# Altium schematic sheet Sheet1.SchDoc
size A4; SheetNumber: 1; SheetTotal: 1; SPICEModelCacheYPGFAYGY: <root> / <DocumentId>YPGFAYGY</DocumentId> / </root>
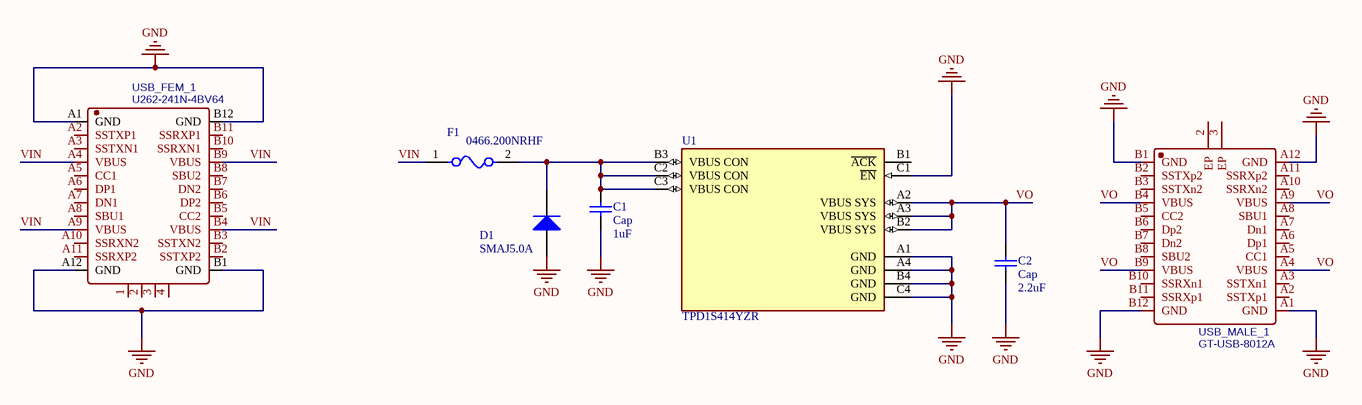
[diagram p0: Sheet1.SchDoc]

## Parts
C1  Cap  value 1uF  [6-0805_N]
C2  Cap  value 2.2uF  [6-0805_N]
D1  SMAJ5.0A  [BOUR-SMA-2_V]
F1  0466.200NRHF  [FP-0466-MFG]
U1  TPD1S414YZR  [FP-YZ0012-C02-MFG]
USB_FEM_1  U262-241N-4BV64  [usbc-female]
USB_MALE_1  GT-USB-8012A  [PCBComponent_1]

## Nets
GND: C1.1 C2.1 D1.1(A) U1.A1(GND) U1.A4(GND) U1.B4(GND) U1.C1(~{EN}) U1.C4(GND) USB_FEM_1.A1(GND) USB_FEM_1.A12(GND) USB_FEM_1.B1(GND) USB_FEM_1.B12(GND) USB_MALE_1.A1(GND) USB_MALE_1.A12(GND) USB_MALE_1.B1(GND) USB_MALE_1.B12(GND)
VIN: F1.1 USB_FEM_1.A4(VBUS) USB_FEM_1.A9(VBUS) USB_FEM_1.B4(VBUS) USB_FEM_1.B9(VBUS)
VO: C2.2 U1.A2(VBUS_SYS) U1.A3(VBUS_SYS) U1.B2(VBUS_SYS) USB_MALE_1.A4(VBUS) USB_MALE_1.A9(VBUS) USB_MALE_1.B4(VBUS) USB_MALE_1.B9(VBUS)
NetC1_2: C1.2 D1.2(K) F1.2 U1.B3(VBUS_CON) U1.C2(VBUS_CON) U1.C3(VBUS_CON)

Not connected (* = marked no-connect by the designer): U1 B1(~{ACK}); USB_FEM_1 1 2 3 4 A2(SSTXP1) A3(SSTXN1) A5(CC1) A6(DP1) A7(DN1) A8(SBU1) A10(SSRXN2) A11(SSRXP2) B2(SSTXP2) B3(SSTXN2) B5(CC2) B6(DP2) B7(DN2) B8(SBU2) B10(SSRXN1) B11(SSRXP1); USB_MALE_1 2(EP) 3(EP) A2(SSTXp1) A3(SSTXn1) A5(CC1) A6(Dp1) A7(Dn1) A8(SBU1) A10(SSRXn2) A11(SSRXp2) B2(SSTXp2) B3(SSTXn2) B5(CC2) B6(Dp2) B7(Dn2) B8(SBU2) B10(SSRXn1) B11(SSRXp1)

## Library data of the parts
C1 = Cap: 0805B105K500NT; Published: 8-Jun-2000; LatestRevisionDate: 17-Jul-2002; LatestRevisionNote: Re-released for DXP Platform.; PackageReference: RAD-0.3; Publisher: Altium Limited; PackageDescription: Radial Cap, Thru-Hole; 2 Leads; 0.3 in Pin Spacing
C2 = Cap: 0805F225M500NT; Published: 8-Jun-2000; LatestRevisionDate: 17-Jul-2002; LatestRevisionNote: Re-released for DXP Platform.; PackageReference: RAD-0.3; Publisher: Altium Limited; PackageDescription: Radial Cap, Thru-Hole; 2 Leads; 0.3 in Pin Spacing
D1 = CMP-2000-07090-1: SMAJ Transient Voltage Suppressor Diode Series, 3.5 V, -55 to 150 degC, 2-Pin SMA, RoHS, Tape and Reel; Manufacturer: Bourns; EDA / CAD Models: DownloadfromAcceleratedDesigns; Unidirectional Channels: 1; Voltage - Breakdown (Min): 6.4V; Voltage - Reverse Standoff (Typ): 5V; Voltage - Clamping (Max) @ Ipp: 9.2V; Other Names: SMAJ5.0ABDKR; Type: Zener; Catalog Drawings: SMAJSeriesFootprintSMAJ,SMBJSeries; Featured Product: SMAJ/SMBJ/SMCJ/SMLJDiscreteTVSDiodes; Power - Peak Pulse: 400W; Current - Peak Pulse (10/1000µs): 43.5A; Power Line Protection: No; Online Catalog: SMAJSeries; Supplier Device Package: SMA(DO-214AC); Operating Temperature: -55°C~150°C(TJ); Package Description: 2-Pin Surface Mount Device, Body 4.315 x 2.605 mm; Datasheet URL: https://datasheet.ciiva.com/25624/0900766b8112213b-25624680.pdf; Manufacturer URL: http://www.bourns.com/; Datasheet Version: 08/2012; Series: SMAJ; Family: TVS-Diodes; Bidirectional Channels: -; Applications: GeneralPurpose; Package Reference: SMA-2; Standard Package: 1; Package / Case: DO-214AC,SMA; Category: CircuitProtection; RoHS Information: SMAJSeriesMaterialDeclaration; Mounting Technology: SurfaceMount; Capacitance @ Frequency: -; Packaging: Digi-Reel®; Mounting Type: SurfaceMount
F1 = CMP-08605-000096-1: FUSE BOARD MNT 200MA 125VAC/VDC; Approvals: UL; Voltage Rating (DC): 125V; Power Dissipation: 50.9mW; Fuse Type: Board Mount (Cartridge Style Excluded); DC Cold Resistance: 1.16R; Housing Material: Ceramic; Length: 3.18mm; Package Quantity: 5000; Current: 200mA; Min Operating Temperature: -55°C; Case Code (Imperial): 1206; Max Operating Temperature: 90°C; Series: SlimLine™ 466; Current Rating: 200mA; Case Code (Metric): 3216; RoHS Compliant: Yes; Depth: 1.52mm; Voltage Rating (AC): 125V; Number of Pins: 2; Lead Free: Contains Lead; Mount: Surface Mount; Height: 0.023inch; Radiation Hardening: No; Width: 0.06inch; Packaging: Tape and Reel; Case/Package: SMD/SMT
U1 = CMP-04910-000132-1: IC PWR SWITCH N-CHAN 1:1 12DSBGA; Output Configuration: High Side; Input Current: 3.5A; Number of Outputs: 1; Operating Supply Voltage: 30V; Fault Protection: Over Temperature; Interface: USB; RoHS Compliant: Yes; Operating Supply Current: 3.5A; Radiation Hardening: No; Max Operating Temperature: 85°C; Lead Free: Lead Free; Number of Pins: 12; Packaging: Tape and Reel; Package Quantity: 3000; Number of Channels: 1; Min Operating Temperature: -40°C
USB_FEM_1 = U262-241N-4BV64: Female USB-TYPE-C; BOM_Manufacturer: XKB Enterprise; Contributor: LCSC; BOM_Supplier: LCSC; BOM_Supplier Part: C388660; BOM_Manufacturer Part: U262-241N-4BV64; BOM_JLCPCB Part Class: Extended Part; spicePre: U; spiceSymbolName: U262-241N-4BV64
USB_MALE_1 = GT-USB-8012A: MALE-USB-TYPE-C; BOM_Manufacturer: G-Switch(品赞); Contributor: lcsc; BOM_Supplier: LCSC; BOM_Supplier Part: C2982483; BOM_Manufacturer Part: GT-USB-8012A; link: https://atta.szlcsc.com/upload/public/pdf/source/20220429/9F8815E2CFA8FB68F0FB0689B355DC71.pdf; BOM_JLCPCB Part Class: Extended Part; spicePre: U; spiceSymbolName: GT-USB-8012A